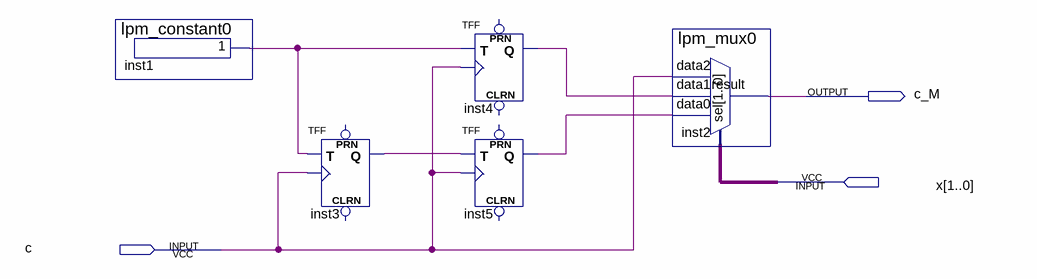
[diagram p0: schematic sheet]
// Quartus schematic output_tact.bdf as structural Verilog: 5 symbols, 3 pins
module output_tact (
  input  [1:0] x,
  input  c,
  output c_M
);

  wire inst1_result, inst3_q, inst4_q, inst5_q;

  lpm_constant0 inst1 (.result(inst1_result));
  TFF inst3 (.T(inst1_result), .CLK(c), .Q(inst3_q));  // open: PRN, CLRN
  TFF inst4 (.T(inst1_result), .CLK(c), .Q(inst4_q));  // open: PRN, CLRN
  TFF inst5 (.T(inst3_q), .CLK(c), .Q(inst5_q));  // open: PRN, CLRN
  lpm_mux0 inst2 (.data2(c), .data1(inst4_q), .data0(inst5_q), .sel(x), .result(c_M));
endmodule
